# Altium schematic sheet Power.SchDoc
size A4
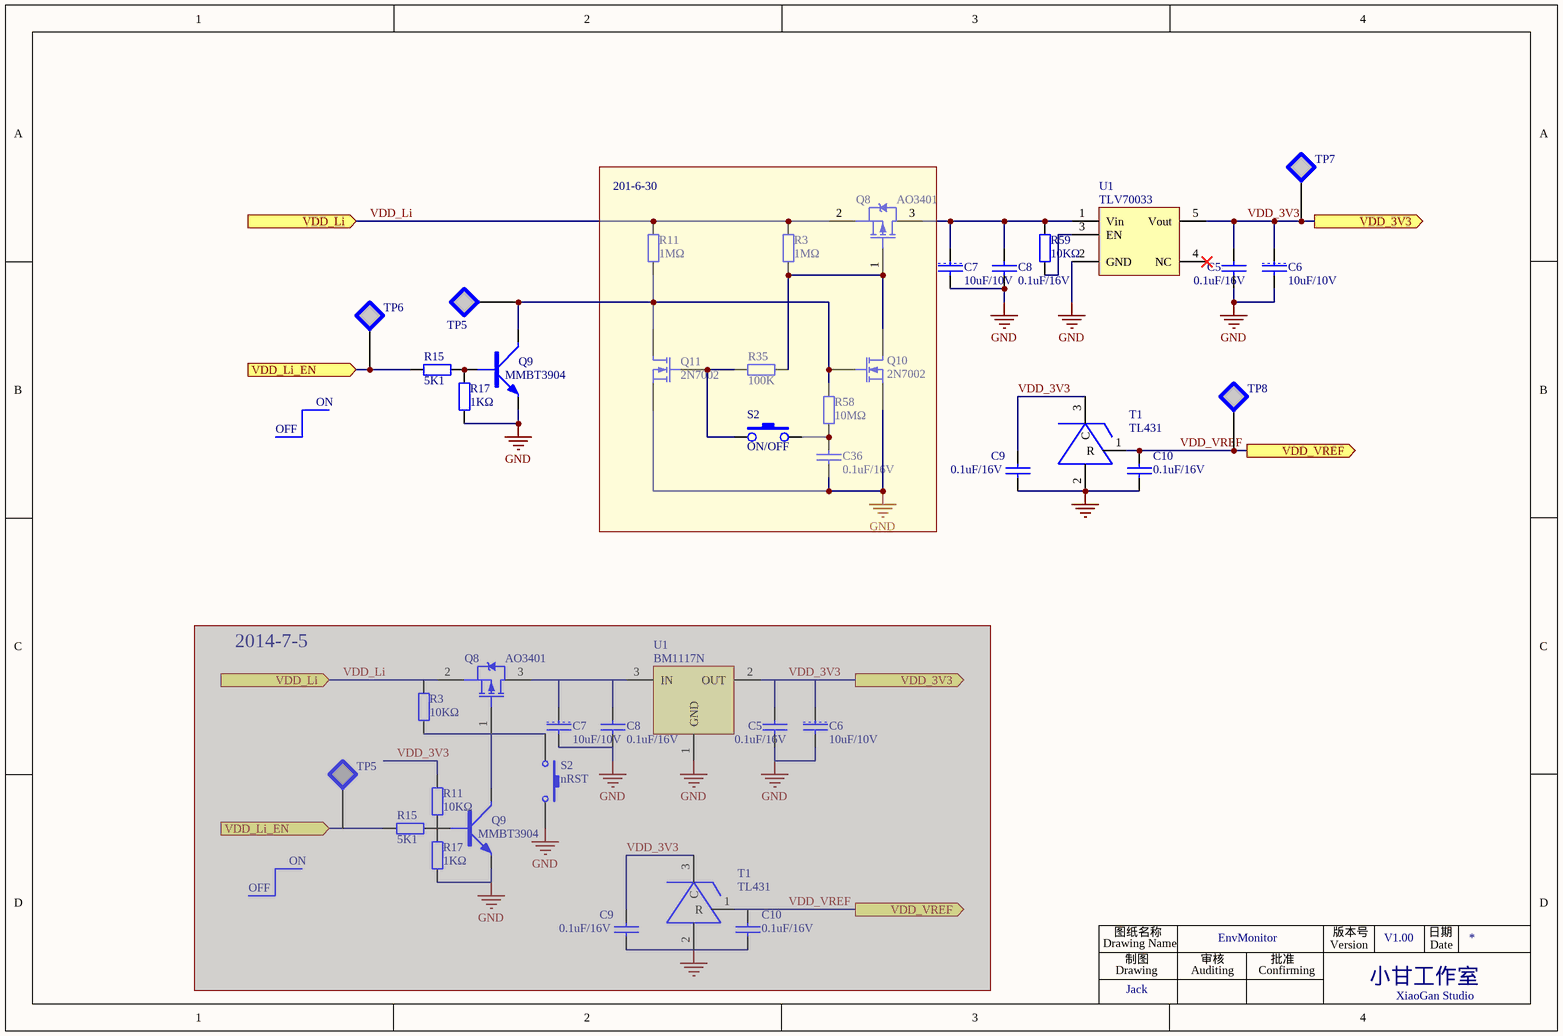
[diagram p0: Power.SchDoc]

## Parts
(Parts that share a designator on the sheet are numbered #1, #2 ... from top to bottom, then left to right.)
C5#1  0.1uF/16V  [0603R]
C5#2  0.1uF/16V  [0603R]  (masked out: inside a compile mask, not in the netlist)
C6#1  10uF/10V  [0805R]
C6#2  10uF/10V  [0805R]  (masked out: inside a compile mask, not in the netlist)
C7#1  10uF/10V  [0805R]
C7#2  10uF/10V  [0805R]  (masked out: inside a compile mask, not in the netlist)
C8#1  0.1uF/16V  [0603R]
C8#2  0.1uF/16V  [0603R]  (masked out: inside a compile mask, not in the netlist)
C9#1  0.1uF/16V  [0603R]
C9#2  0.1uF/16V  [0603R]  (masked out: inside a compile mask, not in the netlist)
C10#1  0.1uF/16V  [0603R]
C10#2  0.1uF/16V  [0603R]  (masked out: inside a compile mask, not in the netlist)
C36  0.1uF/16V  [0805R]
Q8#1  AO3401  [SOT-23]
Q8#2  AO3401  [SOT-23]  (masked out: inside a compile mask, not in the netlist)
Q9#1  MMBT3904  [SOT-23]
Q9#2  MMBT3904  [SOT-23]  (masked out: inside a compile mask, not in the netlist)
Q10  2N7002  [SOT-23]
Q11  2N7002  [SOT-23]
R3#1  1MΩ  [0603R]
R3#2  10KΩ  [0603R]  (masked out: inside a compile mask, not in the netlist)
R11#1  1MΩ  [0603R]
R11#2  10KΩ  [0603R]  (masked out: inside a compile mask, not in the netlist)
R15#1  5K1  [0603R]
R15#2  5K1  [0603R]  (masked out: inside a compile mask, not in the netlist)
R17#1  1KΩ  [0603R]
R17#2  1KΩ  [0603R]  (masked out: inside a compile mask, not in the netlist)
R35  100K  [0603R]
R58  10MΩ  [0603R]
R59  10KΩ  [0603R]
S2#1  ON/OFF  [KEY-6S]
S2#2  nRST  [SPST-2]  (masked out: inside a compile mask, not in the netlist)
T1#1  TL431  [TL-431]
T1#2  TL431  [TL-431]  (masked out: inside a compile mask, not in the netlist)
TP5#1  (no value)  [MARKER-C]  (no BOM)
TP5#2  (no value)  [MARKER-C]  (no BOM)  (masked out: inside a compile mask, not in the netlist)
TP6  (no value)  [MARKER-C]  (no BOM)
TP7  (no value)  [MARKER-C]  (no BOM)
TP8  (no value)  [MARKER-C]  (no BOM)
U1#1  TLV70033  [SOT-23-5]
U1#2  BM1117N  [TO-252]  (masked out: inside a compile mask, not in the netlist)

## Blocks framed on the sheet
201-6-30: C36 Q8#1 Q10 Q11 R3#1 R11#1 R35 R58 S2#1

## Ports
VDD_3V3 (out), VDD_Li (in), VDD_Li_EN (in), VDD_VREF (out)

## Nets
GND: C5#1.2 C6#1.2 C7#1.2 C8#1.2 C9#1.2 C10#1.2 C36.2 Q9#1.2 Q10.2(S) Q11.2(S) R17#1.1 T1#1.2 U1#1.2(GND)
VDD_3V3: C5#1.1 C6#1.1 C9#1.1 T1#1.3(C) TP7.0 U1#1.5(Vout) ; port VDD_3V3
VDD_Li: Q8#1.2(S) R3#1.2 R11#1.2 ; port VDD_Li
VDD_Li_EN: R15#1.2 TP6.0 ; port VDD_Li_EN
VDD_VREF: C10#1.1 T1#1.1(R) TP8.0 ; port VDD_VREF
NetC7#1_1: C7#1.1 C8#1.1 Q8#1.3(D) R59.2 U1#1.1(Vin)
NetC36_1: C36.1 R58.2 S2#1.2
NetQ8#1_1: Q8#1.1(G) Q10.3(D) R3#1.1 R35.1
NetQ9#1_1: Q9#1.1 R15#1.1 R17#1.2
NetQ9#1_3: Q9#1.3 Q10.1(G) Q11.3(D) R11#1.1 R58.1 TP5#1.0
NetQ11_1: Q11.1(G) R35.2 S2#1.1
NetR59_1: R59.1 U1#1.3(EN)

Not connected (* = marked no-connect by the designer): U1#1 4(NC)*

## Notes on the sheet
- OFF
- ON
- 2014-7-5
- Drawing Name
- 图纸名称
- Drawing
- 制图
- Auditing
- 审核
- EnvMonitor
- Confirming
- 批准
- Version
- 版本号
- 小甘工作室
- V1.00
- 日期
- Date
- Jack
- XiaoGan Studio

## Library data of the parts
C5#1 C5#2 C6#1 C6#2 C7#1 C7#2 C8#1 C8#2 C9#1 C9#2 C10#1 C10#2 C36 = CAP: 贴片陶瓷电容; Kind: 贴片陶瓷电容
  C6#1 C6#2 C7#1 C7#2: Author: 叶建峰
Q8#1 Q8#2 = DMP3098L: -30V,-3.8A   PMOS  70-120mΩ; Manufacturer: DIODES; Kind: 贴片MOS管; Remark: 关键元器件
Q9#1 Q9#2 = 9013: NPN三极管; Kind: 贴片三极管
Q10 Q11 = MOSFET-N: N-Channel MOSFET; PackageDocument: 1995/1996; Published: 8-Jun-2000; LatestRevisionDate: 17-Jul-2002; LatestRevisionNote: Re-released for DXP Platform.; PackageReference: E3; Publisher: Altium Limited
R3#1 R3#2 R11#1 R11#2 R15#1 R15#2 R17#1 R17#2 R35 R58 R59 = RES_0603: OEMs: *; Type: 10KΩ; Package: 0603
S2#1 = SW-PB
S2#2 = SW-PB: Switch; Published: 24-Mar-1999; LatestRevisionDate: 17-Jul-2002; LatestRevisionNote: Re-released for DXP Platform.; PackageReference: SPST-2; Publisher: Altium Limited
TP5#1 TP5#2 TP6-TP8 = TESTPOINT: Test Point; Author: 叶建峰
U1#1 U1#2 = AZ1084